# EAGLE design conn_board_v1 (EAGLE 6.4)
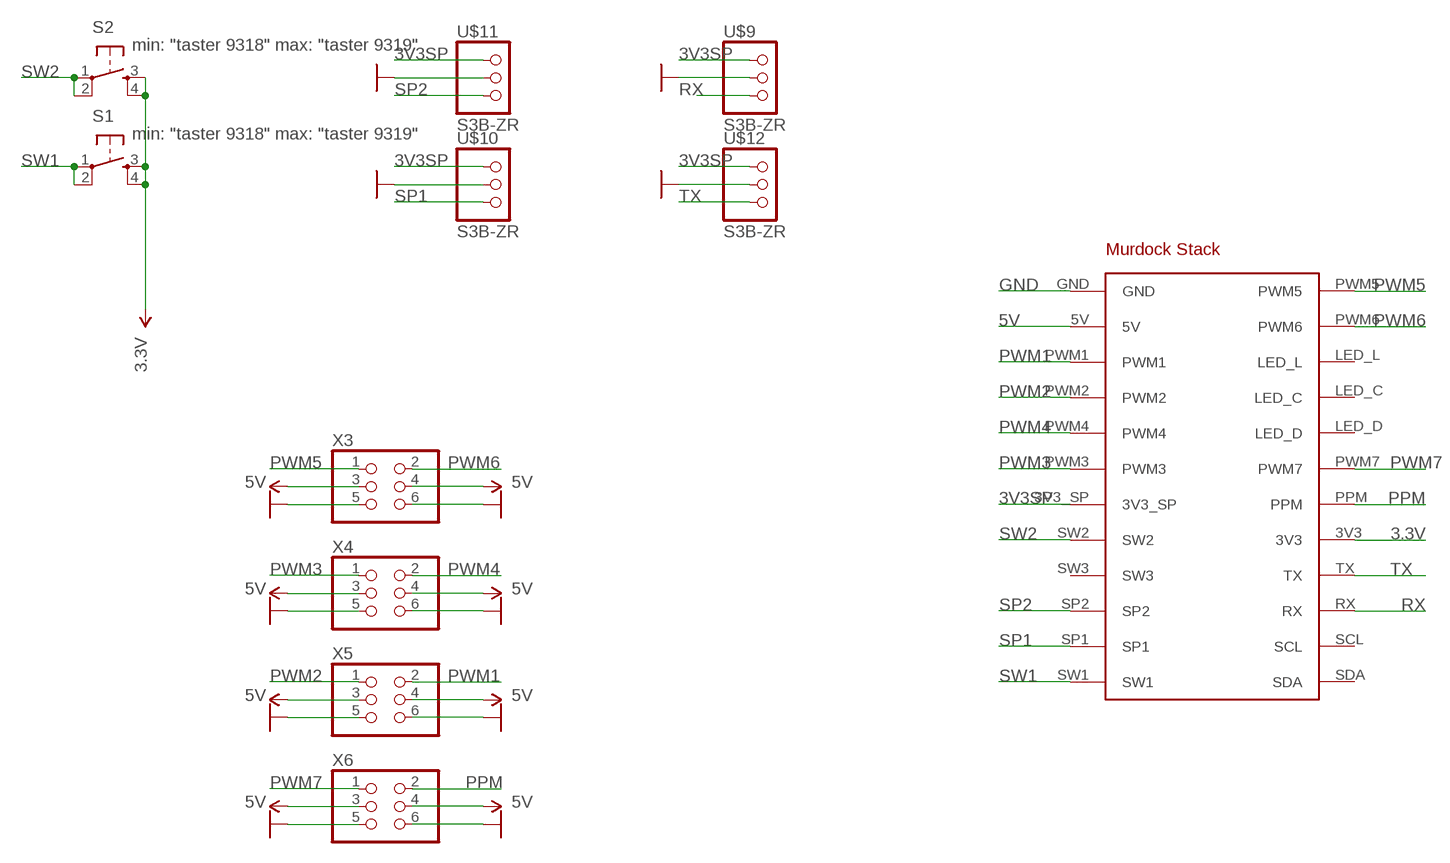
[diagram p0: schematic, sheet 1]

## Parts
S1  min: "taster 9318" max: "taster 9319"  LSH  [LSH]
S2  min: "taster 9318" max: "taster 9319"  LSH  [LSH]
U$9  S3B-ZR  [S3B-ZR]
U$10  S3B-ZR  [S3B-ZR]
U$11  S3B-ZR  [S3B-ZR]
U$12  S3B-ZR  [S3B-ZR]
X3  PINHD-2X3/90  [2X03/90]
X4  PINHD-2X3/90  [2X03/90]
X5  PINHD-2X3/90  [2X03/90]
X6  PINHD-2X3/90  [2X03/90]
X7  MURDOCK_STACK  [MURDOCK_STACK]

## Nets
3.3V: S1.3 S1.4 S2.3 S2.4 X7.3V3
3V3SP: U$9.1 U$10.1 U$11.1 U$12.1 X7.3V3_SP
5V: X3.3 X3.4 X4.3 X4.4 X5.3 X5.4 X6.3 X6.4 X7.5V
GND: U$9.2 U$10.2 U$11.2 U$12.2 X3.5 X3.6 X4.5 X4.6 X5.5 X5.6 X6.5 X6.6 X7.GND
PPM: X6.2 X7.PPM
PWM1: X5.2 X7.PWM1
PWM2: X5.1 X7.PWM2
PWM3: X4.1 X7.PWM3
PWM4: X4.2 X7.PWM4
PWM5: X3.1 X7.PWM5
PWM6: X3.2 X7.PWM6
PWM7: X6.1 X7.PWM7
RX: U$9.3 X7.RX
SP1: U$10.3 X7.SP1
SP2: U$11.3 X7.SP2
SW1: S1.1 S1.2 X7.SW1
SW2: S2.1 S2.2 X7.SW2
TX: U$12.3 X7.TX
Unconnected: X7.LED_C X7.LED_D X7.LED_L X7.SCL X7.SDA X7.SW3

## Library data of the parts
S1 S2 = switch-tact:LSH
U$9-U$12 = seb:S3B-ZR
X3-X6 = pinhead:PINHD-2X3: PIN HEADER
X7 = murdock:MURDOCK_STACK

## Board
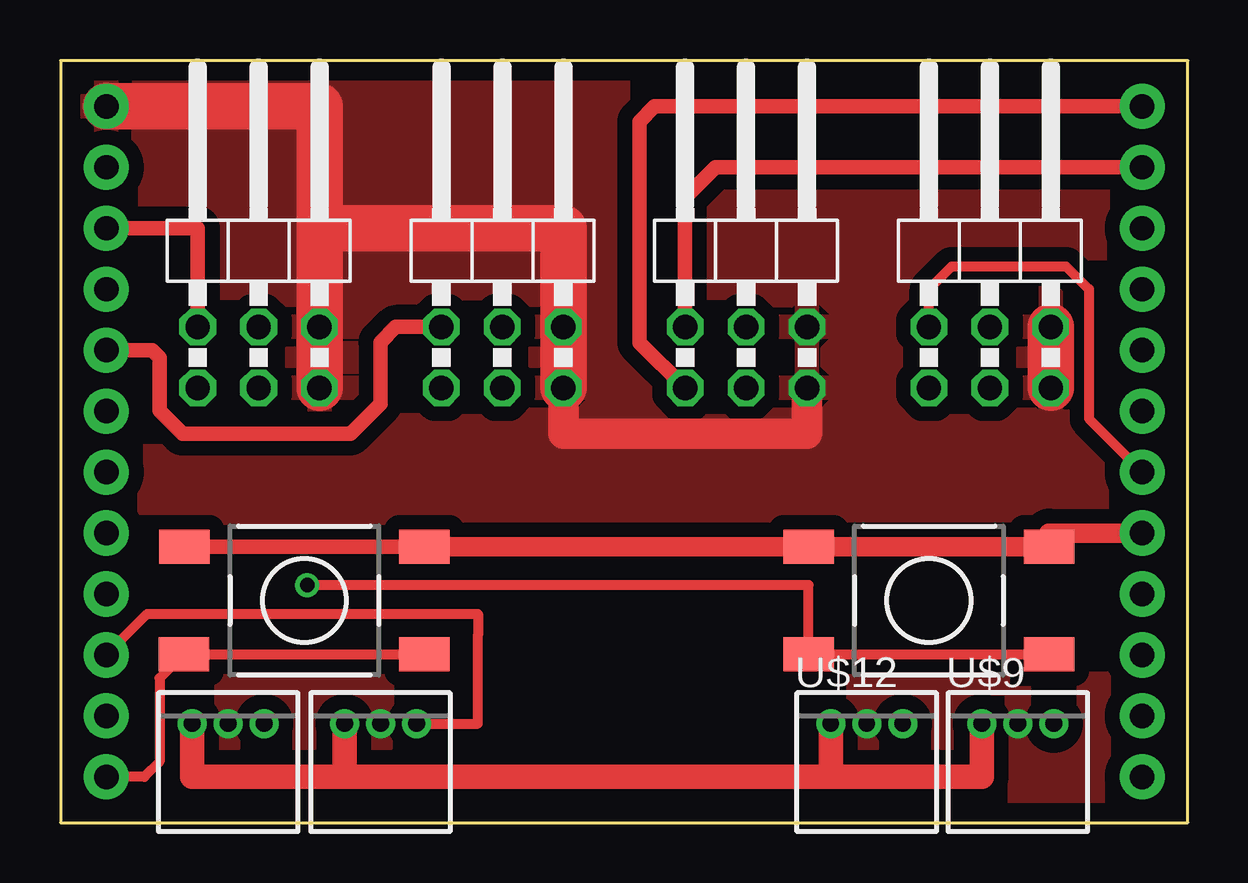
[diagram p1: board, top side]
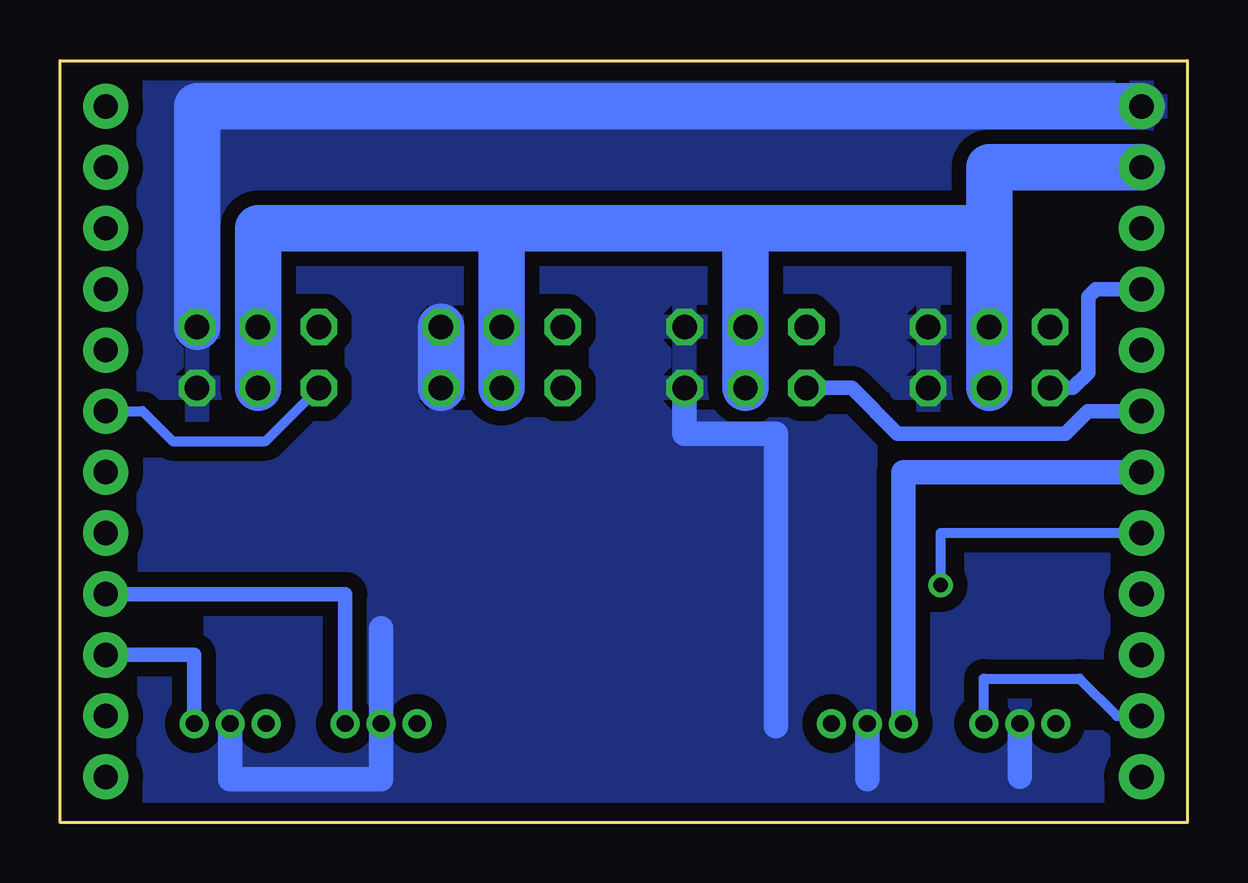
[diagram p2: board, bottom side, seen from below]

Size 46.99 x 31.75 mm. Coordinates in mm from the lower left corner, seen from the top.
Copper layers (1*16): Top 0.035mm / dielectric 1.5mm / Bottom 0.035mm
Design rules "default": minimum track width 10mil, minimum drill 0.4mm, track to track 8mil, track to pad 8mil, pad to pad 8mil, via to via 8mil, smd to smd 8mil, copper to edge 30mil, drill to drill 8mil, minimum pad ring 10mil, minimum via ring 8mil, stop-mask expansion 4mil, vias tented up to drill 1.5mm, thermal gap 10mil

### Footprints (pad centres in the part's own frame; a part is rotated, then mirrored left to right if it is on the bottom)
LSH = smd 2.1 x 1.4: 1 -5.005,2.24; 2 5.015,2.24; 3 -5.005,-2.24; 4 5.005,-2.24
S3B-ZR = drill 0.7 pad 1.1: 1 -1.5,0; 2 0,0; 3 1.5,0
2X03/90 = drill 1.016 octagon: 1 -2.54,-6.35; 2 -2.54,-3.81; 3 0,-6.35; 4 0,-3.81; 5 2.54,-6.35; 6 2.54,-3.81
MURDOCK_STACK = drill 1.016 pad 1.88: 3V3 45.085,12.065; 3V3_SP 1.905,14.605; 5V 1.905,27.305; GND 1.905,29.845; LED_C 45.085,22.225; LED_D 45.085,19.685; LED_L 45.085,24.765; PPM 45.085,14.605; PWM1 1.905,24.765; PWM2 1.905,22.225; PWM3 1.905,17.145; PWM4 1.905,19.685; PWM5 45.085,29.845; PWM6 45.085,27.305; PWM7 45.085,17.145; RX 45.085,6.985; SCL 45.085,4.445; SDA 45.085,1.905; SP1 1.905,4.445; SP2 1.905,6.985; SW1 1.905,1.905; SW2 1.905,12.065; SW3 1.905,9.525; TX 45.085,9.525

### Placement (x,y rotation side)
S1  10.16,9.26 180 top
S2  36.2,9.26 180 top
U$9  39.9,4.13 0 top
U$10  6.99,4.13 0 top
U$11  13.34,4.13 0 top
U$12  33.6,4.13 0 top
X3  28.57,24.46 0 top
X4  18.41,24.46 0 top
X5  8.26,24.46 0 top
X6  38.73,24.46 0 top
X7  0,0 0 top

### Tracks (layer width: path | path; a pad name or v marks a point on that pad's centre or on a via)
3.3V
  Top 0.61: S1.4 S1.3
  Top 0.813: X7.3V3 41.2,12.06 S2.3 S2.4 S1.3
3V3SP
  Top 1.016: U$10.1 5.49,1.91 11.84,1.91 | U$11.1 11.84,1.91 | 11.84,1.91 32.1,1.91 | 32.1,1.91 U$12.1 | U$9.1 38.4,1.91 32.1,1.91
  Bottom 1.016: X7.3V3_SP 11.84,14.61 U$11.1
5V
  Bottom 1.93: X5.3 X5.4 8.26,24.77 | 18.41,24.77 X4.4 X4.3 | 18.41,24.77 8.26,24.77 | 28.57,24.77 X3.4 X3.3 | 28.57,24.77 18.41,24.77 | 28.57,24.77 38.73,24.77 X6.4 X6.3 | X7.5V 8.26,27.3 8.26,24.77
GND
  Top 1.27: X4.5 20.95,16.19 31.11,16.19 X3.5
  Top 1.93: 10.79,24.77 X5.6 X5.5 | 10.79,24.77 20.95,24.77 X4.6 X4.5 | X6.6 X6.5 | 10.79,24.77 10.79,29.84 X7.GND
  Bottom 1.016: 17.14,4 17.14,16.19 20.95,16.19 X4.5 | U$10.2 6.99,1.91 | U$11.2 13.34,1.8 | U$9.2 39.9,1.8 33.6,1.8 U$12.2 33.6,8.1
  Bottom 1.93: X6.6 41.27,29.84 X7.GND | X3.6 X3.5
  pour Top (isolate 0.61): -0.64,32.38 -0.64,-0.64 47.31,-0.64 47.31,32.38
  pour Bottom (isolate 0.61): -0.64,32.38 -0.64,-0.64 47.31,-0.64 47.31,32.38
PPM
  Top 0.406: X6.2 36.2,22.23 37.15,23.18 41.91,23.18 42.86,22.23 42.86,16.83 X7.PPM
PWM1
  Top 0.61: X7.PWM1 5.71,24.77 X5.2
PWM2
  Bottom 0.61: X5.1 4.76,18.11 4.13,18.75 4.13,21.91 3.81,22.23 X7.PWM2
PWM3
  Bottom 0.61: X4.1 13.99,18.11 12.08,16.21 5.08,16.21 4.14,17.14 X7.PWM3
PWM4
  Top 0.61: X4.2 13.97,20.66 13.34,20.02 13.34,17.46 12.08,16.21 5.08,16.21 4.13,17.16 4.13,19.37 3.81,19.68 X7.PWM4
PWM5
  Top 0.61: X3.1 24.13,20 24.13,29.21 24.77,29.84 X7.PWM5
PWM6
  Top 0.61: X3.2 26.04,26.04 27.3,27.3 X7.PWM6
PWM7
  Bottom 0.406: X7.PWM7 43.55,17.14 42.3,15.9 38.41,15.9 X6.1
RX
  Bottom 0.61: U$9.3 41.4,6.99 X7.RX
SP1
  Bottom 0.406: U$10.3 8.48,6 4.5,6 2.94,4.45 X7.SP1
SP2
  Top 0.406: U$11.3 17.4,4.13 17.4,7.8 17.4,8.7 16.5,8.7 3.62,8.7 X7.SP2
SW1
  Top 0.406: S1.1 S1.2 4.13,6.01 4.13,2.54 3.49,1.91 X7.SW1
SW2  (via drill 0.6)
  Top 0.406: S2.1 S2.2 31.18,7.24 31.18,9.89 v10.28,9.89
  Bottom 0.406: X7.SW2 9.31,12.06 10.28,12.06 v10.28,9.89
TX
  Bottom 0.61: U$12.3 35.1,9.53 X7.TX